# Altium project Extension PSoC.PrjPCB
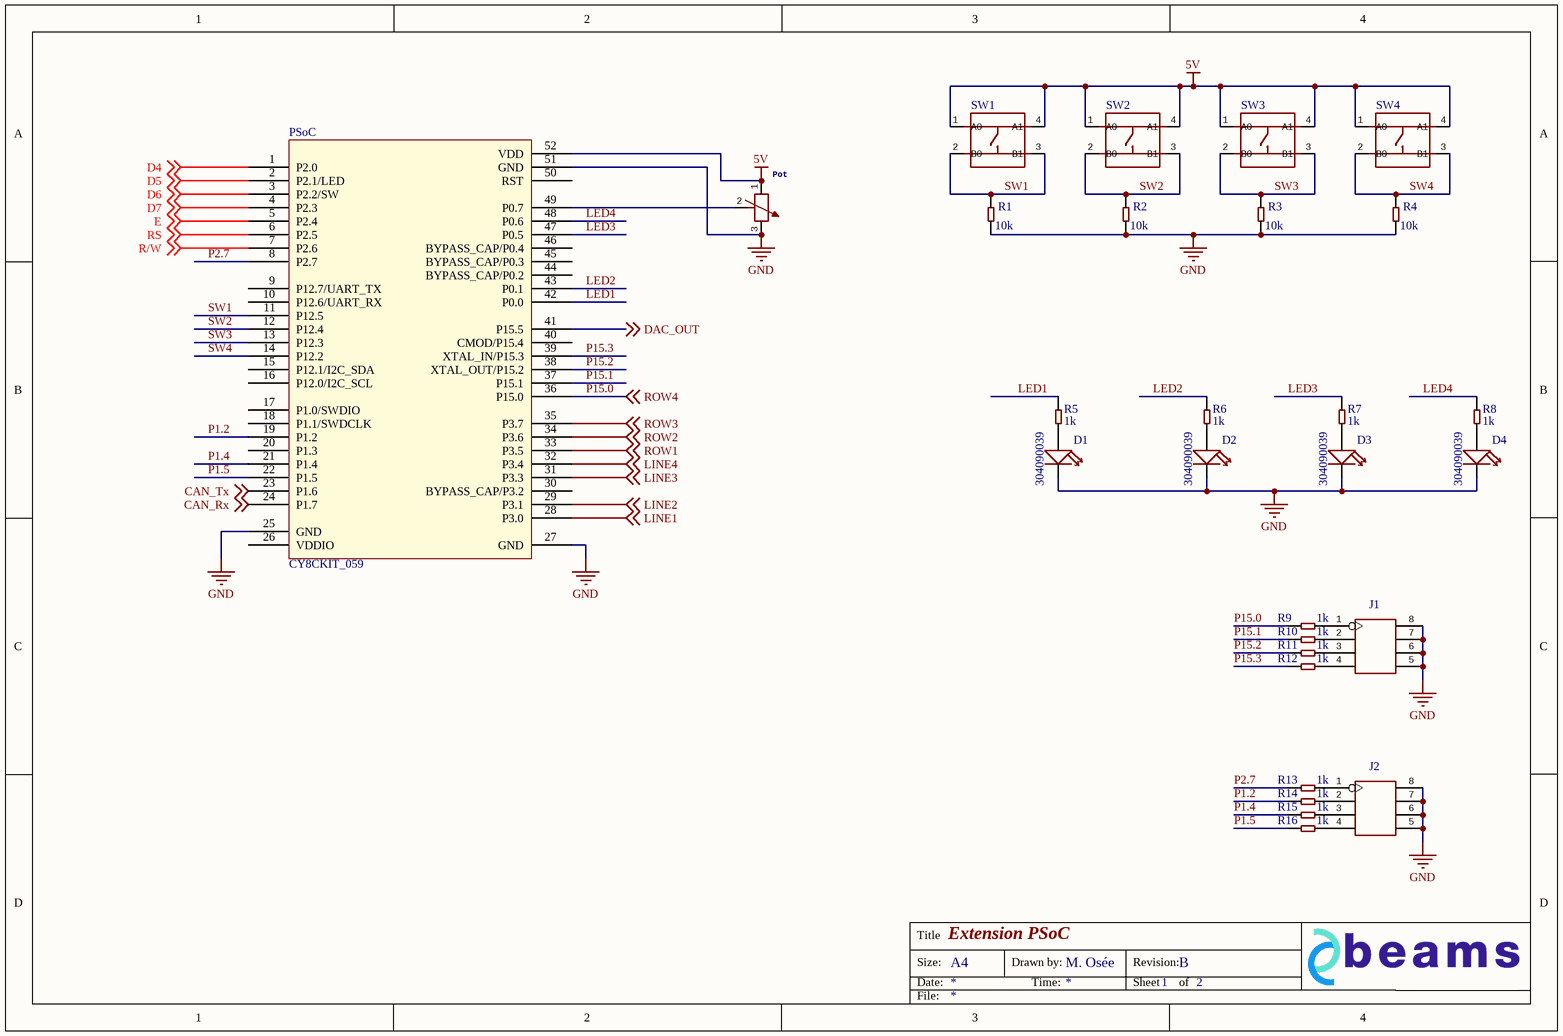
[diagram p0: Sheet1.SchDoc]
2 sheets, 43 parts. Net scope: global (net labels, ports and power ports of the same name join across sheets).
Board file: PCB1.PcbDoc
Sheets:
  Sheet1.SchDoc
  Sheet2.SchDoc

## Sheet Sheet1.SchDoc: Extension PSoC
size A4; DrawnBy: M. Osée; Revision: B; SheetNumber: 1; SheetTotal: 2

### Parts
D1  304090039  [LED-0805]
D2  304090039  [LED-0805]
D3  304090039  [LED-0805]
D4  304090039  [LED-0805]
J1  320030087  [H2X4-2.54]  (value not drawn)
J2  320030087  [H2X4-2.54]  (value not drawn)
Pot  301040022  [ADJR2+3P-11.0X9.8X12.0MM]  (value not drawn)
PSoC  CY8CKIT_059  [CY8CKIT-059]
R1  value 10k  [R0805]  (hidden comment: 301010361)
R2  value 10k  [R0805]  (hidden comment: 301010361)
R3  value 10k  [R0805]  (hidden comment: 301010361)
R4  value 10k  [R0805]  (hidden comment: 301010361)
R5  value 1k  [R0603]  (hidden comment: 301010298)
R6  value 1k  [R0603]  (hidden comment: 301010298)
R7  value 1k  [R0603]  (hidden comment: 301010298)
R8  value 1k  [R0603]  (hidden comment: 301010298)
R9  value 1k  [R0603]  (hidden comment: 301010298)
R10  value 1k  [R0603]  (hidden comment: 301010298)
R11  value 1k  [R0603]  (hidden comment: 301010298)
R12  value 1k  [R0603]  (hidden comment: 301010298)
R13  value 1k  [R0603]  (hidden comment: 301010298)
R14  value 1k  [R0603]  (hidden comment: 301010298)
R15  value 1k  [R0603]  (hidden comment: 301010298)
R16  value 1k  [R0603]  (hidden comment: 301010298)
SW1  311020024  [SW4-6.0X6.0X5.0MM]  (value not drawn)
SW2  311020024  [SW4-6.0X6.0X5.0MM]  (value not drawn)
SW3  311020024  [SW4-6.0X6.0X5.0MM]  (value not drawn)
SW4  311020024  [SW4-6.0X6.0X5.0MM]  (value not drawn)

### Nets
5V: Pot.1 PSoC.52(VDD) SW1.1(A0) SW1.4(A1) SW2.1(A0) SW2.4(A1) SW3.1(A0) SW3.4(A1) SW4.1(A0) SW4.4(A1)
GND: D1.- D2.- D3.- D4.- J1.5 J1.6 J1.7 J1.8 J2.5 J2.6 J2.7 J2.8 Pot.3 Pot.P1 Pot.P2 PSoC.25(GND) PSoC.27(GND) PSoC.51(GND) R1.1 R2.1 R3.1 R4.1
CAN_Rx: PSoC.24(P1.7) ; off-sheet CAN_Rx
CAN_Tx: PSoC.23(P1.6) ; off-sheet CAN_Tx
D4: PSoC.1(P2.0) ; off-sheet D4
D5: PSoC.2(P2.1/LED) ; off-sheet D5
D6: PSoC.3(P2.2/SW) ; off-sheet D6
D7: PSoC.4(P2.3) ; off-sheet D7
DAC_OUT: PSoC.41(P15.5) ; off-sheet DAC_OUT
E: PSoC.5(P2.4) ; off-sheet E
LED1: PSoC.42(P0.0) R5.2
LED2: PSoC.43(P0.1) R6.2
LED3: PSoC.47(P0.5) R7.2
LED4: PSoC.48(P0.6) R8.2
LINE1: PSoC.28(P3.0) ; off-sheet LINE1
LINE2: PSoC.29(P3.1) ; off-sheet LINE2
LINE3: PSoC.31(P3.3) ; off-sheet LINE3
LINE4: PSoC.32(P3.4) ; off-sheet LINE4
P1.2: PSoC.19(P1.2) R14.2
P1.4: PSoC.21(P1.4) R15.2
P1.5: PSoC.22(P1.5) R16.2
P2.7: PSoC.8(P2.7) R13.2
P15.0: PSoC.36(P15.0) R9.2 ; off-sheet ROW4  [also labelled ROW4]
P15.1: PSoC.37(P15.1) R10.2
P15.2: PSoC.38(XTAL_OUT/P15.2) R11.2
P15.3: PSoC.39(XTAL_IN/P15.3) R12.2
R/W: PSoC.7(P2.6) ; off-sheet R/W
ROW1: PSoC.33(P3.5) ; off-sheet ROW1
ROW2: PSoC.34(P3.6) ; off-sheet ROW2
ROW3: PSoC.35(P3.7) ; off-sheet ROW3
RS: PSoC.6(P2.5) ; off-sheet RS
SW1: PSoC.11(P12.5) R1.2 SW1.2(B0) SW1.3(B1)
SW2: PSoC.12(P12.4) R2.2 SW2.2(B0) SW2.3(B1)
SW3: PSoC.13(P12.3) R3.2 SW3.2(B0) SW3.3(B1)
SW4: PSoC.14(P12.2) R4.2 SW4.2(B0) SW4.3(B1)
NetD1_+: D1.+ R5.1
NetD2_+: D2.+ R6.1
NetD3_+: D3.+ R7.1
NetD4_+: D4.+ R8.1
NetJ1_1: J1.1 R9.1
NetJ1_2: J1.2 R10.1
NetJ1_3: J1.3 R11.1
NetJ1_4: J1.4 R12.1
NetJ2_1: J2.1 R13.1
NetJ2_2: J2.2 R14.1
NetJ2_3: J2.3 R15.1
NetJ2_4: J2.4 R16.1
NetPot_2: Pot.2 PSoC.49(P0.7)

Not connected (* = marked no-connect by the designer): PSoC 9(P12.7/UART_TX) 10(P12.6/UART_RX) 15(P12.1/I2C_SDA) 16(P12.0/I2C_SCL) 17(P1.0/SWDIO) 18(P1.1/SWDCLK) 20(P1.3) 26(VDDIO) 30(BYPASS_CAP/P3.2) 40(CMOD/P15.4) 44(BYPASS_CAP/P0.2) 45(BYPASS_CAP/P0.3) 46(BYPASS_CAP/P0.4) 50(RST)

### Notes on the sheet
- Title
- Size:
- Date:
- A4
- Drawn by:
- Time:
- Revision:
- Sheet
- of
- File:

### Library data of the parts
D1-D4 = SMD-LED-CLEAR-YELLOW(0805): MPN: 17-215UYC/S530-A3/TR8
J1 J2 = DIP-BLACK-FEMALE-HEADER(2X4P-2.54)
Pot = DIP-VR-TOP-ADJ-10K(3+2P-11.0X9.8X12.0MM): MPN: WH09-2-103
PSoC = CY8CKIT-059: Published: 24-Mar-1999; LatestRevisionDate: 29-May-2009; Publisher: Altium Limited
R1-R4 = SMD-RES-10K-1%-1/8W(0805): MPN: RC0805FR-0710KL
R5-R16 = SMD-RES-1K-1%-1/10W(0603): MPN: RC0603FR-071KL
SW1-SW4 = DIP-SWITCH-TACTILE-SPST-NO/TS-1109(4P-D6.0MM)'TS-1109'

## Sheet Sheet2.SchDoc: Extension PSoC
size A4; DrawnBy: M. Osée; Organization: ULB - BEAMS; Address1: 50, Av. F. D. Roosevelt; Address2: CP165/56; Address3: 1050 Bruxelles; Revision: B; SheetNumber: 2; SheetTotal: 2
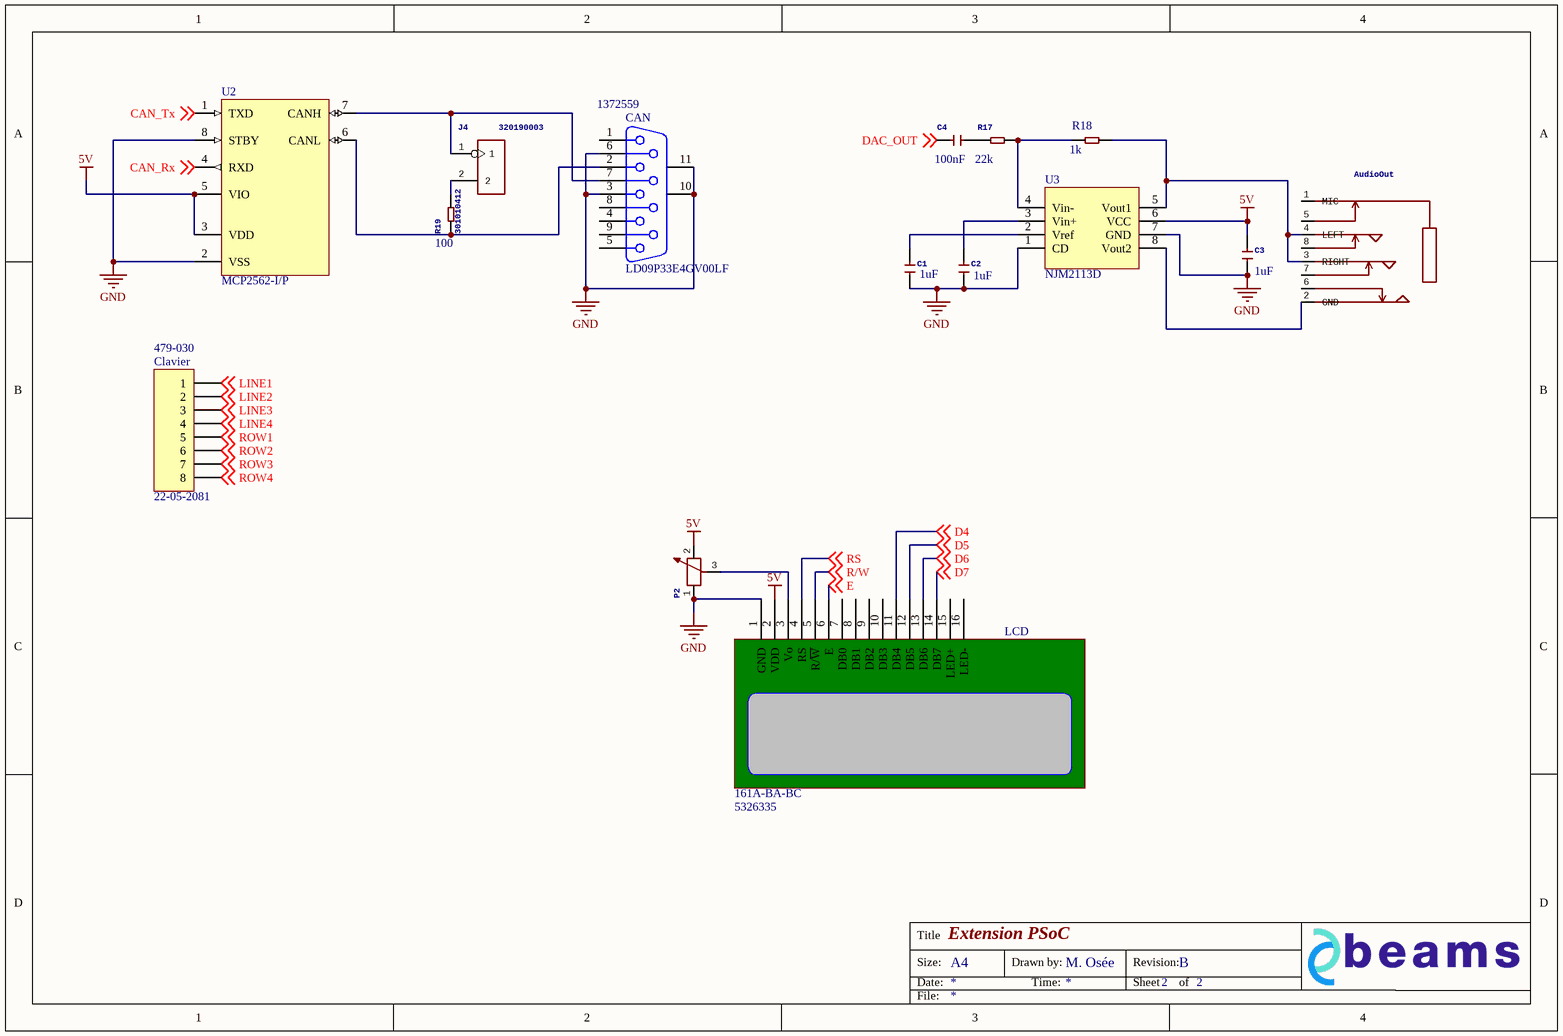
[diagram p1: Sheet2.SchDoc]

### Parts
AudioOut  320040003  [AUDIO8P-SMD-3.5-14.5X6X5MM]  (value not drawn)
C1  value 1uF  [C0805]  (hidden comment: 302010179)
C2  value 1uF  [C0805]  (hidden comment: 302010179)
C3  value 1uF  [C0805]  (hidden comment: 302010179)
C4  value 100nF  [C0603]  (hidden comment: 302010138)
CAN  LD09P33E4GV00LF  Supplier Part Number 1: 1372559  [DSUB1.385-2H9B]
Clavier  22-05-2081  Supplier Part Number 1: 479-030  [HDR1X8H]
J4  320190003  [H2-2.54]
LCD  161A-BA-BC  Supplier Part Number 1: 5326335  [PC161A]
P2  301040007  [ADJR3-9.5X9.5X10.5MM]  (value not drawn)
R17  value 22k  [R0603]  (hidden comment: 301010132)
R18  value 1k  [R0603]  (hidden comment: 301010298)
R19  301010412  value 100  [R1206]
U2  MCP2562-I/P  [DIP8]
U3  NJM2113D  [DIP8]

### Nets
5V: C3.2 LCD.2(VDD) P2.2 U2.3(VDD) U2.5(VIO) U3.6(VCC)
GND: C1.1 C2.1 C3.1 CAN.3 CAN.6 CAN.10(MH1) CAN.11(MH2) LCD.1(GND) P2.1 U2.2(VSS) U2.8(STBY) U3.1(CD) U3.7(GND)
CAN_Rx: U2.4(RXD) ; off-sheet CAN_Rx
CAN_Tx: U2.1(TXD) ; off-sheet CAN_Tx
D4: LCD.11(DB4) ; off-sheet D4
D5: LCD.12(DB5) ; off-sheet D5
D6: LCD.13(DB6) ; off-sheet D6
D7: LCD.14(DB7) ; off-sheet D7
DAC_OUT: C4.1 ; off-sheet DAC_OUT
E: LCD.6(E) ; off-sheet E
LINE1: Clavier.1 ; off-sheet LINE1
LINE2: Clavier.2 ; off-sheet LINE2
LINE3: Clavier.3 ; off-sheet LINE3
LINE4: Clavier.4 ; off-sheet LINE4
R/W: LCD.5(R/~{W}) ; off-sheet R/W
ROW1: Clavier.5 ; off-sheet ROW1
ROW2: Clavier.6 ; off-sheet ROW2
ROW3: Clavier.7 ; off-sheet ROW3
ROW4: Clavier.8 ; off-sheet ROW4  [project net P15.0]
RS: LCD.4(RS) ; off-sheet RS
NetAudioOut_2: AudioOut.2(GND) U3.8(Vout2)
NetAudioOut_3: AudioOut.3(RIGHT) AudioOut.4(LEFT) R18.2 U3.5(Vout1)
NetC1_2: C1.2 U3.2(Vref)
NetC2_2: C2.2 U3.3(Vin+)
NetC4_2: C4.2 R17.1
NetCAN_2: CAN.2 R19.1 U2.6(CANL)
NetCAN_7: CAN.7 J4.1 U2.7(CANH)
NetJ4_2: J4.2 R19.2
NetLCD_3: LCD.3(Vo) P2.3
NetR17_2: R17.2 R18.1 U3.4(Vin-)

Not connected (* = marked no-connect by the designer): AudioOut 1(MIC) 5 6 7 8; CAN 1 4 5 8 9; LCD 7(DB0) 8(DB1) 9(DB2) 10(DB3) 15(LED+) 16(LED-)

### Notes on the sheet
- Title
- Size:
- Date:
- A4
- Drawn by:
- Time:
- Revision:
- Sheet
- of
- File:

### Library data of the parts
AudioOut = AUDIO-JACK-SMD-8P(PJ-3536-L6S): MPN: PJ-3536-L6S
C1-C3 = CERAMIC-1UF-25V-10%-X7R(0805): MPN: CC0805KKX7R8BB105
C4 = CERAMIC-100NF-50V-10%-X7R(0603): MPN: CC0603KRX7R9BB104
CAN = D Connector 9: Receptacle Assembly, 9 Position, Right Angle; PackageDocument: O; Positions: 9; Published: 15-Jun-2001; LatestRevisionDate: 17-Jul-2002; LatestRevisionNote: Re-released for DXP Platform.; DatasheetDocument: 1-Sep-1999; PackageReference: 788750; Publisher: Altium Limited; Orientation: Right Angle; Gender: Receptacle; Supplier 1: RSComponents
Clavier = Header 8H: Header, 8-Pin, Right Angle; LatestRevisionDate: 17-Jul-2002; LatestRevisionNote: Re-released for DXP Platform.; Publisher: Altium Limited; Supplier 1: RSComponents
J4 = DIP-BLACK-JUMPER
LCD = PC161A: Displaytech 16x1 LCD monochrome display; Supplier 1: RSComponents
P2 = DIP-VR-TOP-ADJ-10K(3P-9.5X9.5X5MM): MPN: 3386U-103
R17 = SMD-RES-22K-5%-1/10W(0603): MPN: RC0603JR-0722KL
R18 = SMD-RES-1K-1%-1/10W(0603): MPN: RC0603FR-071KL
R19 = SMD-RES-100R-5%-1/4W(1206): MPN: RC1206JR-07100RL
U2 = MCP2562-I/P: High-Speed CAN Transceiver, 8-Pin PDIP; Manufacturer: Microchip; PartNumber: MCP2551-I/P; DatasheetVersion: revF, Jul-2010; PackageVersion: revBB, Aug-2009; PackageReference: PDIP300-P8; PackageDescription: 8-Lead Plastic Dual In-Line (P) - 300 mil Body [PDIP]; Supplier 1: Digi-Key; Supplier Part Number 1: MCP2551-I/P-ND; Supplier 2: Farnell; Supplier Part Number 2: 1292240; Supplier 3: Newark; Supplier Part Number 3: 61K2947; Supplier 4: Mouser; Supplier Part Number 4: 579-MCP2551-I/P; Mounting Technology: Through Hole; Code_JEDEC: MS-001; ComponentLink1Description: Manufacturer URL; ComponentLink1URL: http://www.microchip.com/; ComponentLink2Description: Datasheet; ComponentLink2URL: http://ww1.microchip.com/downloads/en/DeviceDoc/21667F.pdf; ComponentLink3Description: Package Specification; ComponentLink3URL: http://www.microchip.com/stellent/groups/techpub_sg/documents/packagingspec/en012702.pdf

## Nets that join several sheets
5V: Sheet1 (10 pins), Sheet2 (6 pins)
GND: Sheet1 (22 pins), Sheet2 (13 pins)
CAN_Rx: Sheet1 (PSoC.24), Sheet2 (U2.4)
CAN_Tx: Sheet1 (PSoC.23), Sheet2 (U2.1)
D4: Sheet1 (PSoC.1), Sheet2 (LCD.11)
D5: Sheet1 (PSoC.2), Sheet2 (LCD.12)
D6: Sheet1 (PSoC.3), Sheet2 (LCD.13)
D7: Sheet1 (PSoC.4), Sheet2 (LCD.14)
DAC_OUT: Sheet1 (PSoC.41), Sheet2 (C4.1)
E: Sheet1 (PSoC.5), Sheet2 (LCD.6)
LINE1: Sheet1 (PSoC.28), Sheet2 (Clavier.1)
LINE2: Sheet1 (PSoC.29), Sheet2 (Clavier.2)
LINE3: Sheet1 (PSoC.31), Sheet2 (Clavier.3)
LINE4: Sheet1 (PSoC.32), Sheet2 (Clavier.4)
P15.0: Sheet1 (PSoC.36 R9.2), Sheet2 (Clavier.8)
R/W: Sheet1 (PSoC.7), Sheet2 (LCD.5)
ROW1: Sheet1 (PSoC.33), Sheet2 (Clavier.5)
ROW2: Sheet1 (PSoC.34), Sheet2 (Clavier.6)
ROW3: Sheet1 (PSoC.35), Sheet2 (Clavier.7)
RS: Sheet1 (PSoC.6), Sheet2 (LCD.4)